# Altium schematic sheet S05.SchDoc: Quad Linear Amplifier
size 381 x 254 mm; Revision: 1.6; SheetNumber: 5; SheetTotal: 9
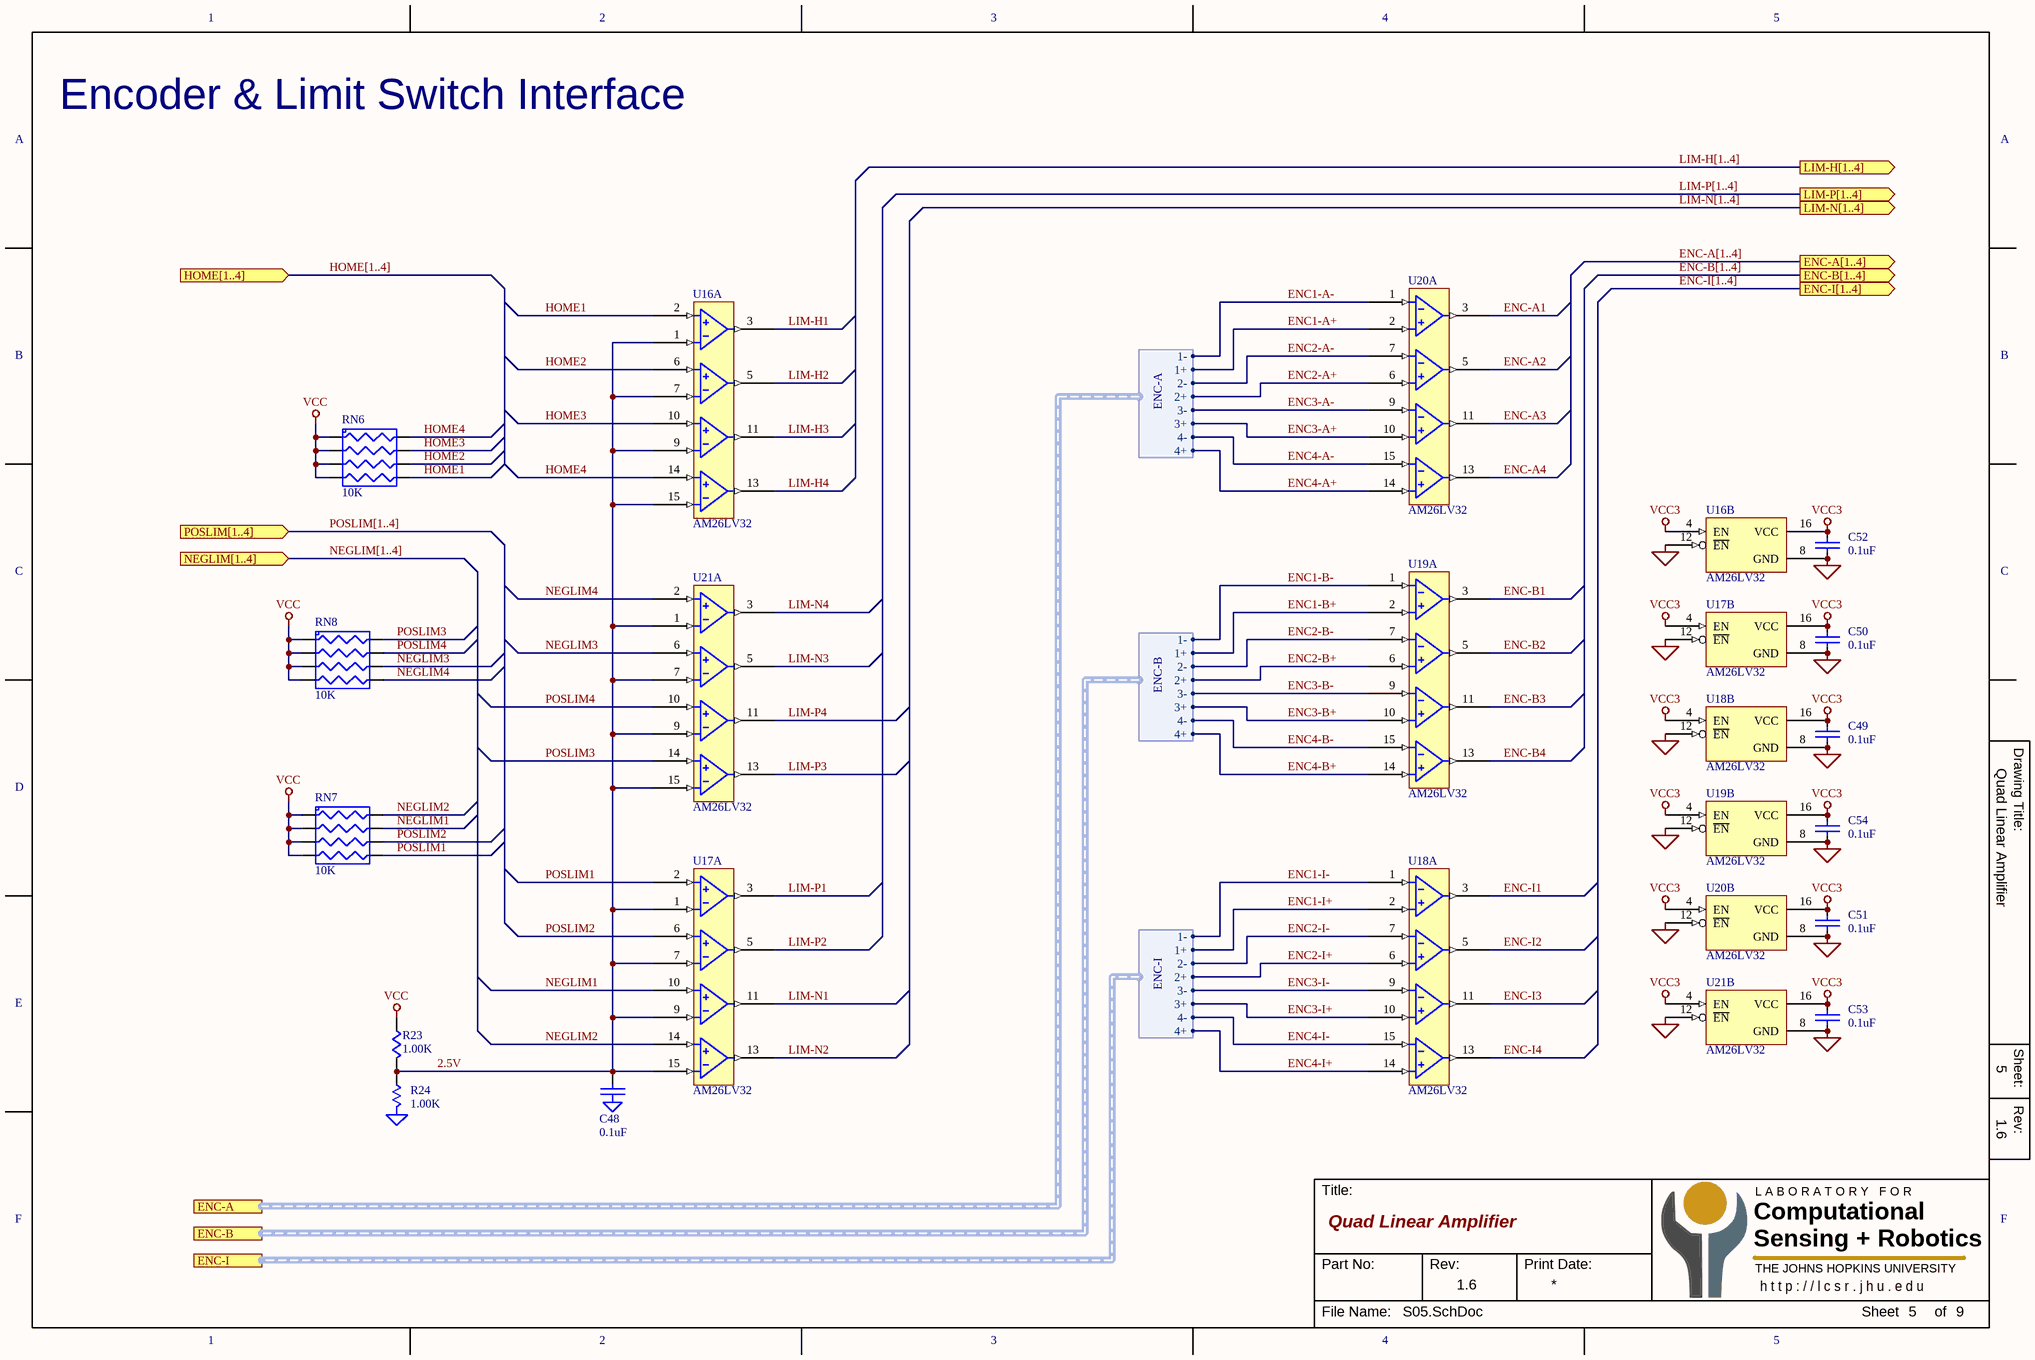
[diagram p0: S05.SchDoc]

## Parts
C48  0.1uF  [C0603]
C49  0.1uF  [C0603]
C50  0.1uF  [C0603]
C51  0.1uF  [C0603]
C52  0.1uF  [C0603]
C53  0.1uF  [C0603]
C54  0.1uF  [C0603]
R23  1.00K  [R0603]
R24  1.00K  [R0603]
RN6  10K  [RN-742C083]
RN7  10K  [RN-742C083]
RN8  10K  [RN-742C083]
U16  AM26LV32  [SO-16]  (parts A,B of 2)
U17  AM26LV32  [SO-16]  (parts A,B of 2)
U18  AM26LV32  [SO-16]  (parts A,B of 2)
U19  AM26LV32  [SO-16]  (parts A,B of 2)
U20  AM26LV32  [SO-16]  (parts A,B of 2)
U21  AM26LV32  [SO-16]  (parts A,B of 2)

## Ports
ENC-A (harness ENC-A), ENC-A[1..4] (out), ENC-B (harness ENC-B), ENC-B[1..4] (out), ENC-I (harness ENC-I), ENC-I[1..4] (out), HOME[1..4] (in), LIM-H[1..4] (out), LIM-N[1..4] (out), LIM-P[1..4] (out), NEGLIM[1..4] (in), POSLIM[1..4] (in)

## Harnesses
ENC-A: 1-, 1+, 2-, 2+, 3-, 3+, 4-, 4+
ENC-B: 1-, 1+, 2-, 2+, 3-, 3+, 4-, 4+
ENC-I: 1-, 1+, 2-, 2+, 3-, 3+, 4-, 4+

## Nets
GND: C48.2(GND) C49.2 C50.2 C51.2 C52.2 C53.2 C54.2 R24.2(GND) U16.8(GND) U16.12(~{EN}) U17.8(GND) U17.12(~{EN}) U18.8(GND) U18.12(~{EN}) U19.8(GND) U19.12(~{EN}) U20.8(GND) U20.12(~{EN}) U21.8(GND) U21.12(~{EN})
VCC: R23.1 RN6.1(R1) RN6.2(R2.1) RN6.3(R3.1) RN6.4(R4.1) RN7.1(R1) RN7.2(R2.1) RN7.3(R3.1) RN7.4(R4.1) RN8.1(R1) RN8.2(R2.1) RN8.3(R3.1) RN8.4(R4.1)
VCC3: C49.1 C50.1 C51.1 C52.1 C53.1 C54.1 U16.4(EN) U16.16(VCC) U17.4(EN) U17.16(VCC) U18.4(EN) U18.16(VCC) U19.4(EN) U19.16(VCC) U20.4(EN) U20.16(VCC) U21.4(EN) U21.16(VCC)
2.5V: C48.1 R23.2 R24.1 U16.1(A-) U16.7(A-) U16.9(A-) U16.15(A-) U17.1(A-) U17.7(A-) U17.9(A-) U17.15(A-) U21.1(A-) U21.7(A-) U21.9(A-) U21.15(A-)
ENC1-A+: U20.2(A+) ; port ENC-A.1+
ENC1-A-: U20.1(A-) ; port ENC-A.1-
ENC1-B+: U19.2(A+) ; port ENC-B.1+
ENC1-B-: U19.1(A-) ; port ENC-B.1-
ENC1-I+: U18.2(A+) ; port ENC-I.1+
ENC1-I-: U18.1(A-) ; port ENC-I.1-
ENC2-A+: U20.6(A+) ; port ENC-A.2+
ENC2-A-: U20.7(A-) ; port ENC-A.2-
ENC2-B+: U19.6(A+) ; port ENC-B.2+
ENC2-B-: U19.7(A-) ; port ENC-B.2-
ENC2-I+: U18.6(A+) ; port ENC-I.2+
ENC2-I-: U18.7(A-) ; port ENC-I.2-
ENC3-A+: U20.10(A+) ; port ENC-A.3+
ENC3-A-: U20.9(A-) ; port ENC-A.3-
ENC3-B+: U19.10(A+) ; port ENC-B.3+
ENC3-B-: U19.9(A-) ; port ENC-B.3-
ENC3-I+: U18.10(A+) ; port ENC-I.3+
ENC3-I-: U18.9(A-) ; port ENC-I.3-
ENC4-A+: U20.14(A+) ; port ENC-A.4+
ENC4-A-: U20.15(A-) ; port ENC-A.4-
ENC4-B+: U19.14(A+) ; port ENC-B.4+
ENC4-B-: U19.15(A-) ; port ENC-B.4-
ENC4-I+: U18.14(A+) ; port ENC-I.4+
ENC4-I-: U18.15(A-) ; port ENC-I.4-
ENC-A1: U20.3(YA)
ENC-A2: U20.5(YA)
ENC-A3: U20.11(YA)
ENC-A4: U20.13(YA)
ENC-B1: U19.3(YA)
ENC-B2: U19.5(YA)
ENC-B3: U19.11(YA)
ENC-B4: U19.13(YA)
ENC-I1: U18.3(YA)
ENC-I2: U18.5(YA)
ENC-I3: U18.11(YA)
ENC-I4: U18.13(YA)
HOME1: RN6.5(R4.2) U16.2(A+)
HOME2: RN6.6(R3.2) U16.6(A+)
HOME3: RN6.7(R2.2) U16.10(A+)
HOME4: RN6.8(R1.2) U16.14(A+)
LIM-H1: U16.3(YA)
LIM-H2: U16.5(YA)
LIM-H3: U16.11(YA)
LIM-H4: U16.13(YA)
LIM-N1: U17.11(YA)
LIM-N2: U17.13(YA)
LIM-N3: U21.5(YA)
LIM-N4: U21.3(YA)
LIM-P1: U17.3(YA)
LIM-P2: U17.5(YA)
LIM-P3: U21.13(YA)
LIM-P4: U21.11(YA)
NEGLIM1: RN7.7(R2.2) U17.10(A+)
NEGLIM2: RN7.8(R1.2) U17.14(A+)
NEGLIM3: RN8.6(R3.2) U21.6(A+)
NEGLIM4: RN8.5(R4.2) U21.2(A+)
POSLIM1: RN7.5(R4.2) U17.2(A+)
POSLIM2: RN7.6(R3.2) U17.6(A+)
POSLIM3: RN8.8(R1.2) U21.14(A+)
POSLIM4: RN8.7(R2.2) U21.10(A+)

## Buses and harness runs
bus ENC-A[1..4] = port ENC-A[1..4]
bus ENC-B[1..4] = port ENC-B[1..4]
bus ENC-I[1..4] = port ENC-I[1..4]
bus HOME[1..4] = port HOME[1..4]
bus LIM-H[1..4] = port LIM-H[1..4]
bus LIM-N[1..4] = port LIM-N[1..4]
bus LIM-P[1..4] = port LIM-P[1..4]
bus NEGLIM[1..4] = port NEGLIM[1..4]
bus POSLIM[1..4] = port POSLIM[1..4]

## Notes on the sheet
- Encoder & Limit Switch Interface
- 1
- 2
- 3
- 4
- 5
- A
- B
- C
- Drawing Title:
- D
- E
- Sheet:
- Rev:
- F
- Title:
- Computational
- Sensing + Robotics
- L A B O R A T O R Y   F O R
- Part No:
- Print Date:
- THE JOHNS HOPKINS UNIVERSITY
- h t t p : / / l c s r . j h u . e d u
- File Name:
- Sheet
- of

## Library data of the parts
C48 = CAP-GND
C49-C54 = CAP-MINI
R23 = R
R24 = R-GND
RN6-RN8 = RN-DISC-SM-4
U16-U21 = DS26LV32AT